# Altium schematic sheet BV100011_ControlConnector.SchDoc
size A3
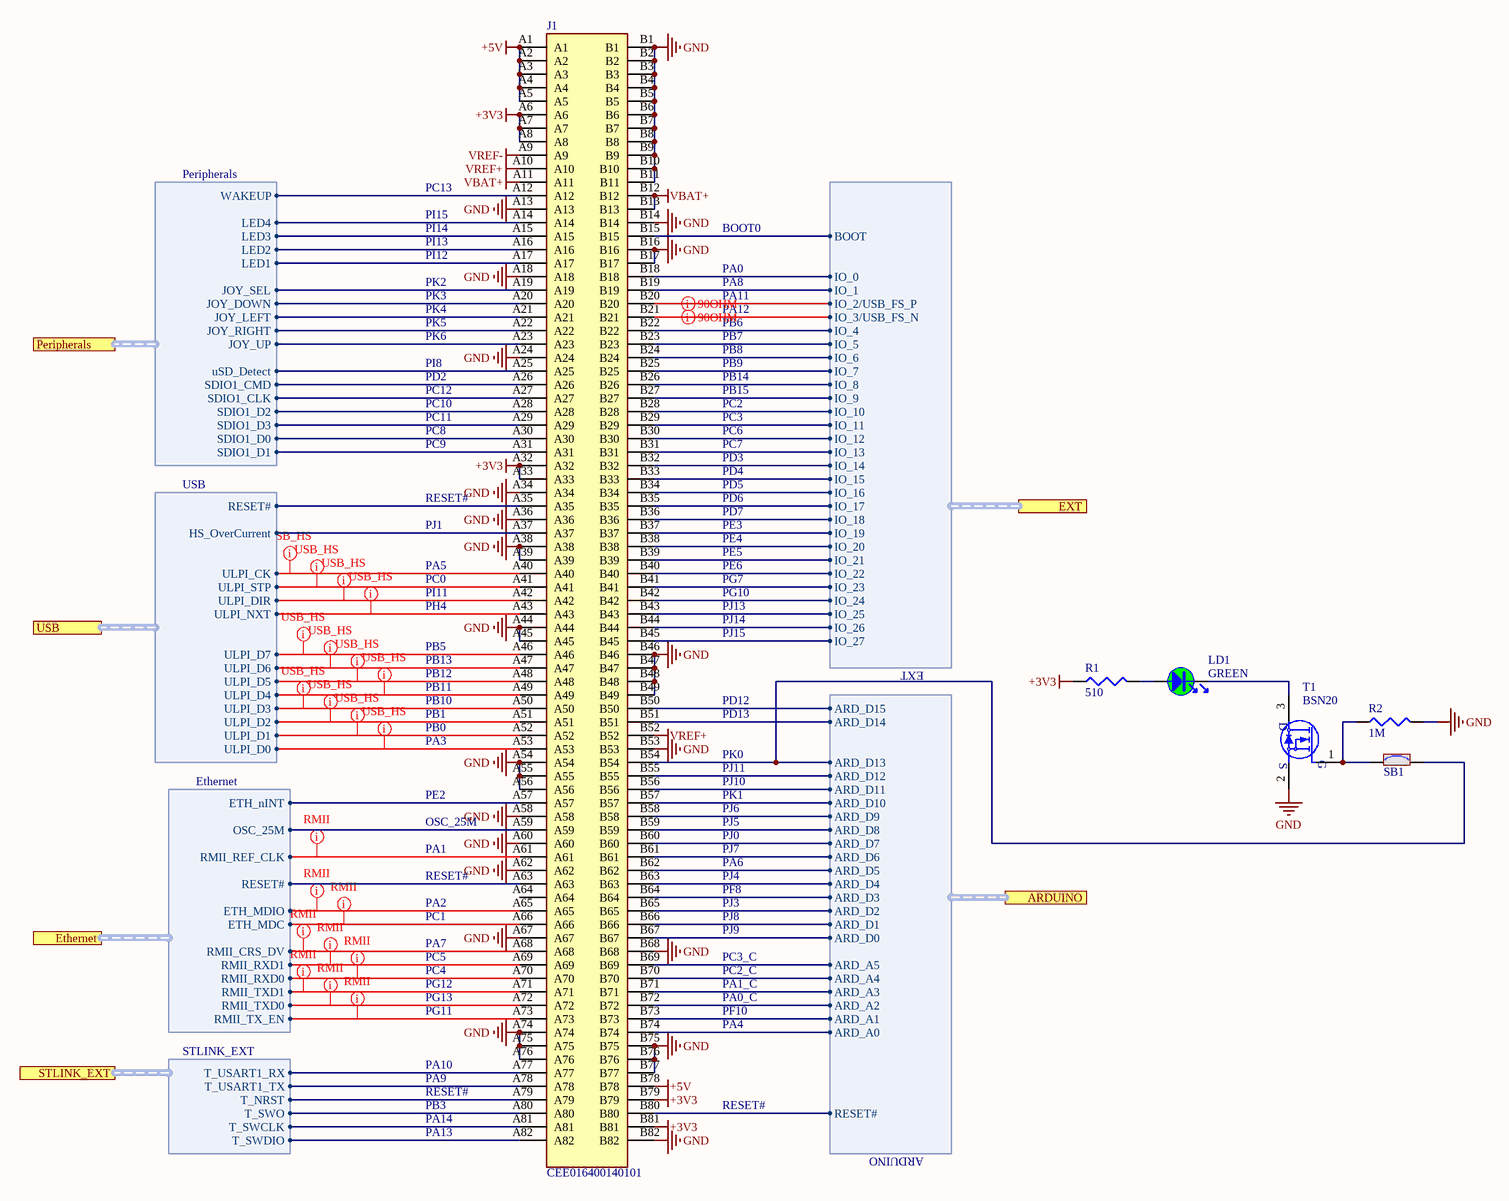
[diagram p0: BV100011_ControlConnector.SchDoc]

## Parts
J1  CEE016400140101  [CEE016400140101-M]
LD1  value GREEN  [LED_0603_GREEN]  (hidden comment: LED_green)
R1  510  [R0603]
R2  1M  [R0603]
SB1  SB_ON  [SB_0603]  (value not drawn)
T1  BSN20  [MOS_SOT23]

## Ports
ARDUINO (harness ARDUINO), Ethernet (harness Ethernet), EXT (harness EXT), Peripherals (harness Peripherals), STLINK_EXT (harness STLINK_EXT), USB (harness USB)

## Harnesses
Ethernet: ETH_nINT, ETH_MDC, RMII_REF_CLK, RMII_TXD1, ETH_MDIO, RMII_CRS_DV, RMII_RXD0, RMII_RXD1, RMII_TX_EN, RMII_TXD0, OSC_25M, RESET#
USB: ULPI_D0, ULPI_D1, ULPI_D2, ULPI_D3, ULPI_D4, ULPI_D5, ULPI_D6, ULPI_D7, ULPI_NXT, ULPI_DIR, ULPI_STP, ULPI_CK, RESET#, HS_OverCurrent
Peripherals: SDIO1_D1, SDIO1_D0, SDIO1_D3, SDIO1_D2, SDIO1_CLK, SDIO1_CMD, uSD_Detect, JOY_UP, JOY_RIGHT, JOY_LEFT, JOY_DOWN, JOY_SEL, LED1, LED2, LED3, LED4, WAKEUP
STLINK_EXT: T_SWDIO, T_SWCLK, T_SWO, T_NRST, T_USART1_TX, T_USART1_RX
ARDUINO: RESET#, ARD_A0, ARD_A1, ARD_A2, ARD_A3, ARD_A4, ARD_A5, ARD_D4, ARD_D3, ARD_D2, ARD_D1, ARD_D0, ARD_D9, ARD_D8, ARD_D7, ARD_D6, ARD_D5, ARD_D14, ARD_D13, ARD_D12, ARD_D11, ARD_D10, ARD_D15
EXT: IO_0, IO_1, IO_3/USB_FS_N, IO_4, IO_5, IO_6, IO_7, IO_8, IO_9, IO_10, IO_11, IO_12, IO_13, IO_14, IO_15, IO_16, IO_17, IO_18, IO_19, IO_20, IO_21, IO_22, IO_23, IO_24, IO_25, IO_26, IO_27, BOOT, IO_2/USB_FS_P

## Nets
+3V3: J1.A6 J1.A7 J1.A8 J1.A32 J1.A33 J1.B79 J1.B81 R1.1
+5V: J1.A1 J1.A2 J1.A3 J1.A4 J1.A5 J1.B78
GND: J1.A13 J1.A18 J1.A24 J1.A34 J1.A36 J1.A38 J1.A39 J1.A44 J1.A45 J1.A54 J1.A55 J1.A56 J1.A58 J1.A60 J1.A62 J1.A67 J1.A74 J1.A75 J1.A76 J1.B1 J1.B2 J1.B3 J1.B4 J1.B5 J1.B6 J1.B7 J1.B8 J1.B9 J1.B10 J1.B11 J1.B14 J1.B16 J1.B17 J1.B46 J1.B47 J1.B48 J1.B49 J1.B53 J1.B68 J1.B75 J1.B76 J1.B77 J1.B82 R2.2 T1.2(S)
VBAT+: J1.A11 J1.B12 J1.B13
VREF+: J1.A10 J1.B52
VREF-: J1.A9
NetJ1_A12: J1.A12 ; port Peripherals.WAKEUP
NetJ1_A14: J1.A14 ; port Peripherals.LED4
NetJ1_A15: J1.A15 ; port Peripherals.LED3
NetJ1_A16: J1.A16 ; port Peripherals.LED2
NetJ1_A17: J1.A17 ; port Peripherals.LED1
NetJ1_A19: J1.A19 ; port Peripherals.JOY_SEL
NetJ1_A20: J1.A20 ; port Peripherals.JOY_DOWN
NetJ1_A21: J1.A21 ; port Peripherals.JOY_LEFT
NetJ1_A22: J1.A22 ; port Peripherals.JOY_RIGHT
NetJ1_A23: J1.A23 ; port Peripherals.JOY_UP
NetJ1_A25: J1.A25 ; port Peripherals.uSD_Detect
NetJ1_A26: J1.A26 ; port Peripherals.SDIO1_CMD
NetJ1_A27: J1.A27 ; port Peripherals.SDIO1_CLK
NetJ1_A28: J1.A28 ; port Peripherals.SDIO1_D2
NetJ1_A29: J1.A29 ; port Peripherals.SDIO1_D3
NetJ1_A30: J1.A30 ; port Peripherals.SDIO1_D0
NetJ1_A31: J1.A31 ; port Peripherals.SDIO1_D1
NetJ1_A35: J1.A35 ; port USB.RESET#
NetJ1_A37: J1.A37 ; port USB.HS_OverCurrent
NetJ1_A40: J1.A40 ; port USB.ULPI_CK
NetJ1_A41: J1.A41 ; port USB.ULPI_STP
NetJ1_A42: J1.A42 ; port USB.ULPI_DIR
NetJ1_A43: J1.A43 ; port USB.ULPI_NXT
NetJ1_A46: J1.A46 ; port USB.ULPI_D7
NetJ1_A47: J1.A47 ; port USB.ULPI_D6
NetJ1_A48: J1.A48 ; port USB.ULPI_D5
NetJ1_A49: J1.A49 ; port USB.ULPI_D4
NetJ1_A50: J1.A50 ; port USB.ULPI_D3
NetJ1_A51: J1.A51 ; port USB.ULPI_D2
NetJ1_A52: J1.A52 ; port USB.ULPI_D1
NetJ1_A53: J1.A53 ; port USB.ULPI_D0
NetJ1_A57: J1.A57 ; port Ethernet.ETH_nINT
NetJ1_A59: J1.A59 ; port Ethernet.OSC_25M
NetJ1_A61: J1.A61 ; port Ethernet.RMII_REF_CLK
NetJ1_A63: J1.A63 ; port Ethernet.RESET#
NetJ1_A65: J1.A65 ; port Ethernet.ETH_MDIO
NetJ1_A66: J1.A66 ; port Ethernet.ETH_MDC
NetJ1_A68: J1.A68 ; port Ethernet.RMII_CRS_DV
NetJ1_A69: J1.A69 ; port Ethernet.RMII_RXD1
NetJ1_A70: J1.A70 ; port Ethernet.RMII_RXD0
NetJ1_A71: J1.A71 ; port Ethernet.RMII_TXD1
NetJ1_A72: J1.A72 ; port Ethernet.RMII_TXD0
NetJ1_A73: J1.A73 ; port Ethernet.RMII_TX_EN
NetJ1_A77: J1.A77 ; port STLINK_EXT.T_USART1_RX
NetJ1_A78: J1.A78 ; port STLINK_EXT.T_USART1_TX
NetJ1_A79: J1.A79 ; port STLINK_EXT.T_NRST
NetJ1_A80: J1.A80 ; port STLINK_EXT.T_SWO
NetJ1_A81: J1.A81 ; port STLINK_EXT.T_SWCLK
NetJ1_A82: J1.A82 ; port STLINK_EXT.T_SWDIO
NetJ1_B15: J1.B15 ; port EXT.BOOT
NetJ1_B18: J1.B18 ; port EXT.IO_0
NetJ1_B19: J1.B19 ; port EXT.IO_1
NetJ1_B20: J1.B20 ; port EXT.IO_2/USB_FS_P
NetJ1_B21: J1.B21 ; port EXT.IO_3/USB_FS_N
NetJ1_B22: J1.B22 ; port EXT.IO_4
NetJ1_B23: J1.B23 ; port EXT.IO_5
NetJ1_B24: J1.B24 ; port EXT.IO_6
NetJ1_B25: J1.B25 ; port EXT.IO_7
NetJ1_B26: J1.B26 ; port EXT.IO_8
NetJ1_B27: J1.B27 ; port EXT.IO_9
NetJ1_B28: J1.B28 ; port EXT.IO_10
NetJ1_B29: J1.B29 ; port EXT.IO_11
NetJ1_B30: J1.B30 ; port EXT.IO_12
NetJ1_B31: J1.B31 ; port EXT.IO_13
NetJ1_B32: J1.B32 ; port EXT.IO_14
NetJ1_B33: J1.B33 ; port EXT.IO_15
NetJ1_B34: J1.B34 ; port EXT.IO_16
NetJ1_B35: J1.B35 ; port EXT.IO_17
NetJ1_B36: J1.B36 ; port EXT.IO_18
NetJ1_B37: J1.B37 ; port EXT.IO_19
NetJ1_B38: J1.B38 ; port EXT.IO_20
NetJ1_B39: J1.B39 ; port EXT.IO_21
NetJ1_B40: J1.B40 ; port EXT.IO_22
NetJ1_B41: J1.B41 ; port EXT.IO_23
NetJ1_B42: J1.B42 ; port EXT.IO_24
NetJ1_B43: J1.B43 ; port EXT.IO_25
NetJ1_B44: J1.B44 ; port EXT.IO_26
NetJ1_B45: J1.B45 ; port EXT.IO_27
NetJ1_B50: J1.B50 ; port ARDUINO.ARD_D15
NetJ1_B51: J1.B51 ; port ARDUINO.ARD_D14
NetJ1_B54: J1.B54 SB1.2 ; port ARDUINO.ARD_D13
NetJ1_B55: J1.B55 ; port ARDUINO.ARD_D12
NetJ1_B56: J1.B56 ; port ARDUINO.ARD_D11
NetJ1_B57: J1.B57 ; port ARDUINO.ARD_D10
NetJ1_B58: J1.B58 ; port ARDUINO.ARD_D9
NetJ1_B59: J1.B59 ; port ARDUINO.ARD_D8
NetJ1_B60: J1.B60 ; port ARDUINO.ARD_D7
NetJ1_B61: J1.B61 ; port ARDUINO.ARD_D6
NetJ1_B62: J1.B62 ; port ARDUINO.ARD_D5
NetJ1_B63: J1.B63 ; port ARDUINO.ARD_D4
NetJ1_B64: J1.B64 ; port ARDUINO.ARD_D3
NetJ1_B65: J1.B65 ; port ARDUINO.ARD_D2
NetJ1_B66: J1.B66 ; port ARDUINO.ARD_D1
NetJ1_B67: J1.B67 ; port ARDUINO.ARD_D0
NetJ1_B69: J1.B69 ; port ARDUINO.ARD_A5
NetJ1_B70: J1.B70 ; port ARDUINO.ARD_A4
NetJ1_B71: J1.B71 ; port ARDUINO.ARD_A3
NetJ1_B72: J1.B72 ; port ARDUINO.ARD_A2
NetJ1_B73: J1.B73 ; port ARDUINO.ARD_A1
NetJ1_B74: J1.B74 ; port ARDUINO.ARD_A0
NetJ1_B80: J1.B80 ; port ARDUINO.RESET#
NetLD1_1: LD1.1 R1.2
NetLD1_2: LD1.2 T1.3(D)
NetR2_1: R2.1 SB1.1 T1.1(G)

Not connected (* = marked no-connect by the designer): J1 A64

## Layout directives
differential pair; differential pair class 90OHM: NetJ1_B20, NetJ1_B21
rule Matched Net Lengths [Tolerance = 100mil]; net class USB_HS: NetJ1_A40, NetJ1_A41, NetJ1_A42, NetJ1_A43, NetJ1_A46, NetJ1_A47, NetJ1_A48, NetJ1_A49, NetJ1_A50, NetJ1_A51, NetJ1_A52, NetJ1_A53
rule Matched Net Lengths [Tolerance = 100mil]; net class RMII: NetJ1_A61, NetJ1_A65, NetJ1_A66, NetJ1_A68, NetJ1_A69, NetJ1_A70, NetJ1_A71, NetJ1_A72, NetJ1_A73

## Notes on the sheet
- PC13
- PI15
- PI14
- PI13
- PI12
- BOOT0
- PK2
- PK3
- PK4
- PK5
- PA0
- PA8
- PA11
- PA12
- PB6
- PK6
- PI8
- PD2
- PC12
- PB7
- PB8
- PB9
- PB14
- PB15
- PC10
- PC11
- PC8
- PC9
- PC2
- PC3
- PC6
- PC7
- PD3
- RESET#
- PJ1
- PD4
- PD5
- PD6
- PD7
- PE3
- PA5
- PC0
- PI11
- PE4
- PE5
- PE6
- PG7
- PG10
- PH4
- PB5
- PB13
- PJ13
- PJ14
- PJ15
- PB12
- PB11
- PB10
- PB1
- PB0
- PD13
- PD12
- PE2
- PA3
- PK1
- PJ10
- PJ11
- PK0
- PA1
- OSC_25M
- PA6
- PJ7
- PJ0
- PJ5
- PJ6
- PA2
- PC1
- PJ9
- PJ8
- PJ3
- PF8
- PJ4
- PA7
- PC5
- PC4
- PG12
- PG13
- PA0_C
- PA1_C
- PC2_C
- PC3_C
- PG11
- PA10
- PA4
- PF10
- PA9
- PB3
- PA14
- PA13

## Library data of the parts
J1 = CEE016400140101: Connector; Manufacturer_Name: Amphenol; Datasheet Link: https://cdn.amphenol-icc.com/media/wysiwyg/files/drawing/ccee0xxx001401yx.pdf; Height: 10.45mm; Manufacturer_Part_Number: CEE016400140101; Mouser Part Number: 523-CEE016400140101; Mouser Price/Stock: https://www.mouser.com/Search/Refine.aspx?Keyword=523-CEE016400140101
LD1 = MCD-00050: LED, Green, 0603; Part_Type: Display; Manufacturer_Part_Number: 19-213SYGC/S530-E2/TR8; Manufacturer: EVERLIGHT; ECCN_US: EAR99; ECCN_EU: NEC; Provided_By: Subcon; Initial_Board_Reference: mb1274; Internal_Part_Number: MCD-00050; Status: Released; ComponentLink1Description: Everlight_SMD-LED-GREEN_19-213SYGC-S530-XX-TR8-v3.doc.pdf; ComponentLink1URL: http://tunmcdsvn.tun.st.com/Component_Datasheet_Library/Trunk/display/Everlight_SMD-LED-GREEN_19-213SYGC-S530-XX-TR8-v3.doc.pdf
R1 R2 = Res3: Resistor; Value: 220; Published: 8-Jun-2000; LatestRevisionDate: 29-May-2009; LatestRevisionNote: IPC-7351 Footprint Added.; PackageReference: J1-0603; Publisher: Altium Limited; PackageDescription: Chip Resistor
SB1 = MCD-00071: Solder Bridge ON; Part_Type: Mechanical; Manufacturer_Part_Number: RC0603JR-070RL; Manufacturer: YAGEO; Provided_By: SUBCO; Internal_Part_Number: MCD-00071; Status: Released; ComponentLink1Description: Datasheet; Package: SB0603; ComponentLink1URL: http://tunmcdsvn.tun.st.com/Component_Datasheet_Library/Trunk/Resistors/Yageo_Resistor_RC0603-series; ECCN_US: n/a; ECCN_EU: n/a
T1 = MCD-00151: N-channel enhancement mode field-effect transistor; Part_Type: IC; Manufacturer: NXP; ECCN_US: EAR99; ECCN_EU: NEC; Provided_By: Subcon; Initial_Board_Reference: mb1262; Internal_Part_Number: MCD-00151; Value: BSN20; Status: Released; Manufacturer_Part_Number: BSN20; ComponentLink1Description: NXP_Transistor_BSN20BK_SOT23.pdf; ComponentLink1URL: http://tunmcdsvn.tun.st.com/Component_Datasheet_Library/Trunk/IC/NXP_Transistor_BSN20BK_SOT23.pdf